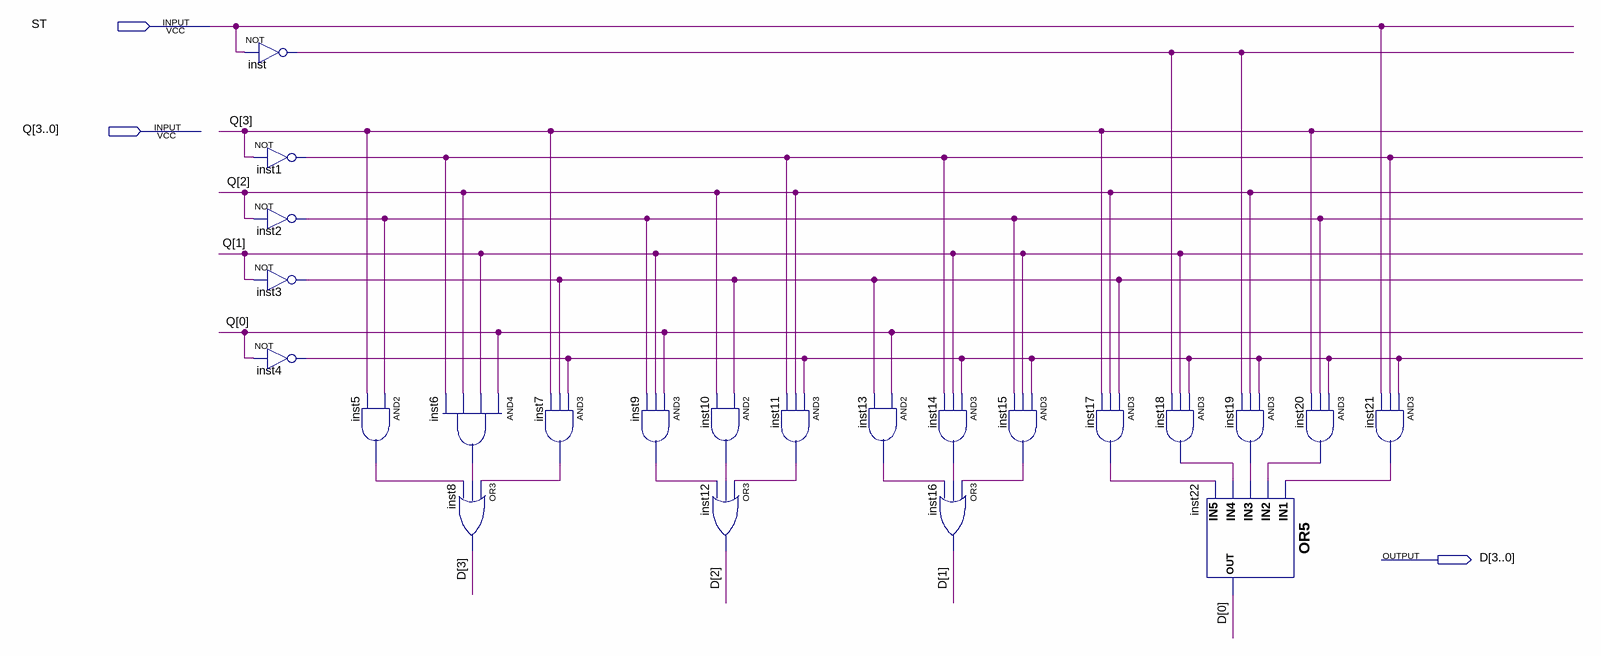
[diagram p0: schematic sheet]
// Quartus schematic NEXT_STAGE.bdf as structural Verilog: 23 symbols, 3 pins
module NEXT_STAGE (
  input  ST,
  input  [3:0] Q,
  output [3:0] D
);

  wire inst1_out, inst2_out, inst3_out, inst4_out, inst5_out, inst6_out, inst7_out, inst9_out, inst10_out,
       inst11_out, inst13_out, inst14_out, inst15_out, inst17_out, inst18_out, inst19_out, inst20_out,
       inst21_out, inst_out;

  not inst (inst_out, ST);
  not inst1 (inst1_out, Q[3]);
  not inst2 (inst2_out, Q[2]);
  not inst3 (inst3_out, Q[1]);
  not inst4 (inst4_out, Q[0]);
  and inst5 (inst5_out, inst2_out, Q[3]);
  and inst6 (inst6_out, Q[0], Q[1], Q[2], inst1_out);
  or inst8 (D[3], inst7_out, inst6_out, inst5_out);
  and inst7 (inst7_out, inst4_out, inst3_out, Q[3]);
  and inst9 (inst9_out, Q[0], Q[1], inst2_out);
  and inst10 (inst10_out, inst3_out, Q[2]);
  or inst12 (D[2], inst11_out, inst10_out, inst9_out);
  and inst11 (inst11_out, inst4_out, Q[2], inst1_out);
  and inst13 (inst13_out, Q[0], inst3_out);
  and inst14 (inst14_out, inst4_out, Q[1], inst1_out);
  or inst16 (D[1], inst15_out, inst14_out, inst13_out);
  and inst15 (inst15_out, inst4_out, Q[1], inst2_out);
  and inst17 (inst17_out, inst3_out, Q[2], Q[3]);
  and inst18 (inst18_out, inst4_out, Q[1], inst_out);
  and inst19 (inst19_out, inst4_out, Q[2], inst_out);
  or inst22 (D[0], inst21_out, inst20_out, inst19_out, inst18_out, inst17_out);
  and inst20 (inst20_out, inst4_out, inst2_out, Q[3]);
  and inst21 (inst21_out, inst4_out, inst1_out, ST);
endmodule
